# Altium schematic sheet KEYPAD.SchDoc
size A4
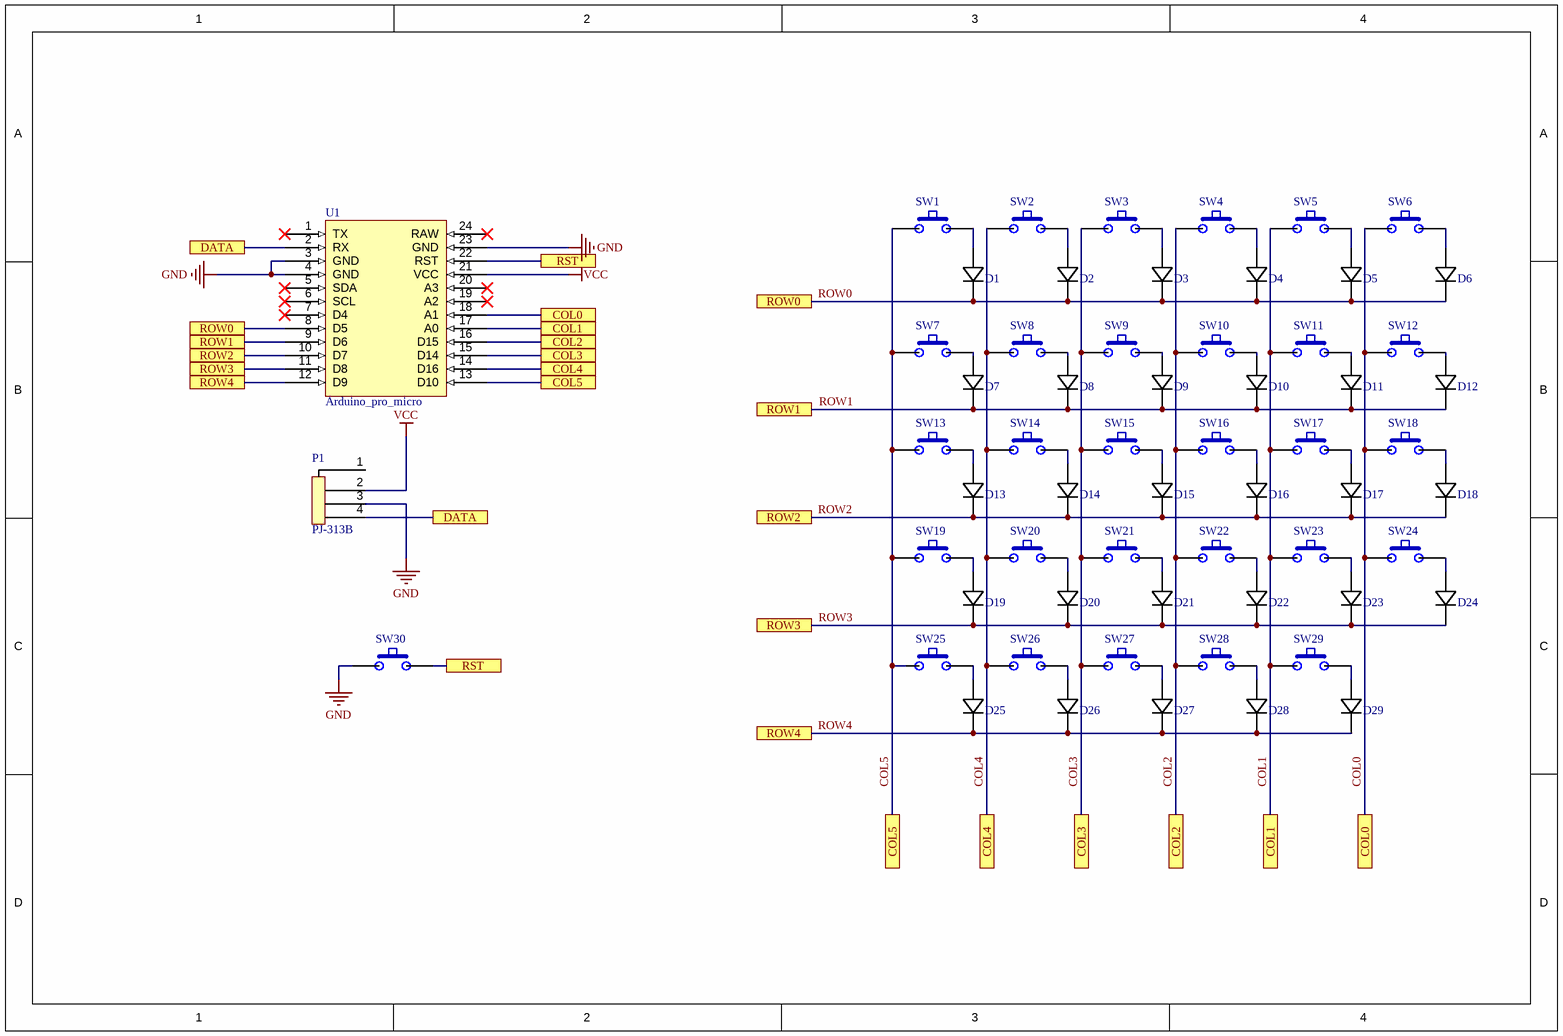
[diagram p0: KEYPAD.SchDoc]

## Parts
D1  1N4148WSF-7  [DIOAD829W49L456D191]  (value not drawn)
D2  1N4148WSF-7  [DIOAD829W49L456D191]  (value not drawn)
D3  1N4148WSF-7  [DIOAD829W49L456D191]  (value not drawn)
D4  1N4148WSF-7  [DIOAD829W49L456D191]  (value not drawn)
D5  1N4148WSF-7  [DIOAD829W49L456D191]  (value not drawn)
D6  1N4148WSF-7  [DIOAD829W49L456D191]  (value not drawn)
D7  1N4148WSF-7  [DIOAD829W49L456D191]  (value not drawn)
D8  1N4148WSF-7  [DIOAD829W49L456D191]  (value not drawn)
D9  1N4148WSF-7  [DIOAD829W49L456D191]  (value not drawn)
D10  1N4148WSF-7  [DIOAD829W49L456D191]  (value not drawn)
D11  1N4148WSF-7  [DIOAD829W49L456D191]  (value not drawn)
D12  1N4148WSF-7  [DIOAD829W49L456D191]  (value not drawn)
D13  1N4148WSF-7  [DIOAD829W49L456D191]  (value not drawn)
D14  1N4148WSF-7  [DIOAD829W49L456D191]  (value not drawn)
D15  1N4148WSF-7  [DIOAD829W49L456D191]  (value not drawn)
D16  1N4148WSF-7  [DIOAD829W49L456D191]  (value not drawn)
D17  1N4148WSF-7  [DIOAD829W49L456D191]  (value not drawn)
D18  1N4148WSF-7  [DIOAD829W49L456D191]  (value not drawn)
D19  1N4148WSF-7  [DIOAD829W49L456D191]  (value not drawn)
D20  1N4148WSF-7  [DIOAD829W49L456D191]  (value not drawn)
D21  1N4148WSF-7  [DIOAD829W49L456D191]  (value not drawn)
D22  1N4148WSF-7  [DIOAD829W49L456D191]  (value not drawn)
D23  1N4148WSF-7  [DIOAD829W49L456D191]  (value not drawn)
D24  1N4148WSF-7  [DIOAD829W49L456D191]  (value not drawn)
D25  1N4148WSF-7  [DIOAD829W49L456D191]  (value not drawn)
D26  1N4148WSF-7  [DIOAD829W49L456D191]  (value not drawn)
D27  1N4148WSF-7  [DIOAD829W49L456D191]  (value not drawn)
D28  1N4148WSF-7  [DIOAD829W49L456D191]  (value not drawn)
D29  1N4148WSF-7  [DIOAD829W49L456D191]  (value not drawn)
P1  PJ-313B  [pj-313b6-x]
SW1  (no value)  [cherry_sw_double_side]
SW2  (no value)  [cherry_sw_double_side]
SW3  (no value)  [cherry_sw_double_side]
SW4  (no value)  [cherry_sw_double_side]
SW5  (no value)  [cherry_sw_double_side]
SW6  (no value)  [cherry_sw_double_side]
SW7  (no value)  [cherry_sw_double_side]
SW8  (no value)  [cherry_sw_double_side]
SW9  (no value)  [cherry_sw_double_side]
SW10  (no value)  [cherry_sw_double_side]
SW11  (no value)  [cherry_sw_double_side]
SW12  (no value)  [cherry_sw_double_side]
SW13  (no value)  [cherry_sw_double_side]
SW14  (no value)  [cherry_sw_double_side]
SW15  (no value)  [cherry_sw_double_side]
SW16  (no value)  [cherry_sw_double_side]
SW17  (no value)  [cherry_sw_double_side]
SW18  (no value)  [cherry_sw_double_side]
SW19  (no value)  [cherry_sw_double_side]
SW20  (no value)  [cherry_sw_double_side]
SW21  (no value)  [cherry_sw_double_side]
SW22  (no value)  [cherry_sw_double_side]
SW23  (no value)  [cherry_sw_double_side]
SW24  (no value)  [cherry_sw_double_side]
SW25  (no value)  [cherry_sw_double_side]
SW26  (no value)  [cherry_sw_double_side]
SW27  (no value)  [cherry_sw_double_side]
SW28  (no value)  [cherry_sw_double_side]
SW29  (no value)  [cherry_sw_double_side]
SW30  (no value)  [DTS-32]
U1  Arduino_pro_micro  [Arduino_pro_micro]

## Ports
COL0, COL1, COL2, COL3, COL4, COL5, DATA, ROW0, ROW1, ROW2, ROW3, ROW4, RST

## Nets
GND: P1.3 SW30.1 U1.3(GND) U1.4(GND) U1.23(GND)
VCC: P1.2 U1.21(VCC)
COL0: SW6.1 SW12.1 SW18.1 SW24.1 U1.18(A1) ; port COL0
COL1: SW5.1 SW11.1 SW17.1 SW23.1 SW29.1 U1.17(A0) ; port COL1
COL2: SW4.1 SW10.1 SW16.1 SW22.1 SW28.1 U1.16(D15) ; port COL2
COL3: SW3.1 SW9.1 SW15.1 SW21.1 SW27.1 U1.15(D14) ; port COL3
COL4: SW2.1 SW8.1 SW14.1 SW20.1 SW26.1 U1.14(D16) ; port COL4
COL5: SW1.1 SW7.1 SW13.1 SW19.1 SW25.1 U1.13(D10) ; port COL5
DATA: P1.4 U1.2(RX) ; port DATA
ROW0: D1.1 D2.1 D3.1 D4.1 D5.1 D6.1 U1.8(D5) ; port ROW0
ROW1: D7.1 D8.1 D9.1 D10.1 D11.1 D12.1 U1.9(D6) ; port ROW1
ROW2: D13.1 D14.1 D15.1 D16.1 D17.1 D18.1 U1.10(D7) ; port ROW2
ROW3: D19.1 D20.1 D21.1 D22.1 D23.1 D24.1 U1.11(D8) ; port ROW3
ROW4: D25.1 D26.1 D27.1 D28.1 D29.1 U1.12(D9) ; port ROW4
RST: SW30.2 U1.22(RST) ; port RST
NetD1_2: D1.2 SW1.2
NetD2_2: D2.2 SW2.2
NetD3_2: D3.2 SW3.2
NetD4_2: D4.2 SW4.2
NetD5_2: D5.2 SW5.2
NetD6_2: D6.2 SW6.2
NetD7_2: D7.2 SW7.2
NetD8_2: D8.2 SW8.2
NetD9_2: D9.2 SW9.2
NetD10_2: D10.2 SW10.2
NetD11_2: D11.2 SW11.2
NetD12_2: D12.2 SW12.2
NetD13_2: D13.2 SW13.2
NetD14_2: D14.2 SW14.2
NetD15_2: D15.2 SW15.2
NetD16_2: D16.2 SW16.2
NetD17_2: D17.2 SW17.2
NetD18_2: D18.2 SW18.2
NetD19_2: D19.2 SW19.2
NetD20_2: D20.2 SW20.2
NetD21_2: D21.2 SW21.2
NetD22_2: D22.2 SW22.2
NetD23_2: D23.2 SW23.2
NetD24_2: D24.2 SW24.2
NetD25_2: D25.2 SW25.2
NetD26_2: D26.2 SW26.2
NetD27_2: D27.2 SW27.2
NetD28_2: D28.2 SW28.2
NetD29_2: D29.2 SW29.2

Not connected (* = marked no-connect by the designer): P1 1; U1 1(TX)* 5(SDA)* 6(SCL)* 7(D4)* 19(A2)* 20(A3)* 24(RAW)*

## Notes on the sheet
- THIS DOCUMENT AND THE DATA DISCLOSED HEREIN OR
- HEREWITH IS THE PROPERTY OF ALTIUM LIMITED AND MAY
- DWG NO:
- REVISION
- REV:
- DESCRIPTION
- DATE
- APPROVED
- BE FREELY DISTRIBUTED IN WHOLE. NO RIGHTS ARE
- RESERVED OR EXPRESS OR IMPLIED WARANTEE GIVEN.
- ENG:
- APPROVALS
- PROJECT
- DSN:
- CHK:
- REFERENCE DOCUMENTS
- PROJECT REVISION:
- TITLE
- DOCUMENT REVISION:
- DESIGN ITEM:
- BOM:
- FAB DWG:
- PCB DWG:
- ASSY DWG:
- SCALE:
- A3
- SIZE
- CAGE CODE
- FILE NAME
- DWG NO.
- SHEET
- OF
- REV

## Library data of the parts
D1-D29 = 1N4148WSF-7: No Description Available; Mfr_Name: Diodes Inc; Type: DEV; Copyright: Copyright (C) 2021 Ultra Librarian. All rights reserved.; Manufacturer_Part_Number: 1N4148WSF-7; Digi-Key_Part_Number_1: 1N4148WSF-7DI-ND; Digi-Key_Part_Number_2: 1N4148WSF-7DICT-ND; Digi-Key_Part_Number_3: 1N4148WSF-7DIDKR-ND; Digi-Key_Part_Number_4: 1N4148WSF-7DITR-ND; RefDes: RefDes
SW1-SW30 = SW